# Altium schematic sheet МПСУ.464421.22-01 Switch,GPS, IO Connectors.SchDoc
size 420 x 297 mm; Address1: Address1; Address2: Address2; Address3: Address3; Address4: Address4; SheetNumber: 5; SheetTotal: 6; DocumentTypeSCH: Э3; DocumentName1SCH: Плата; NachOtdelaSCH: Орешкин; UtverjdenSCH: Утвержден
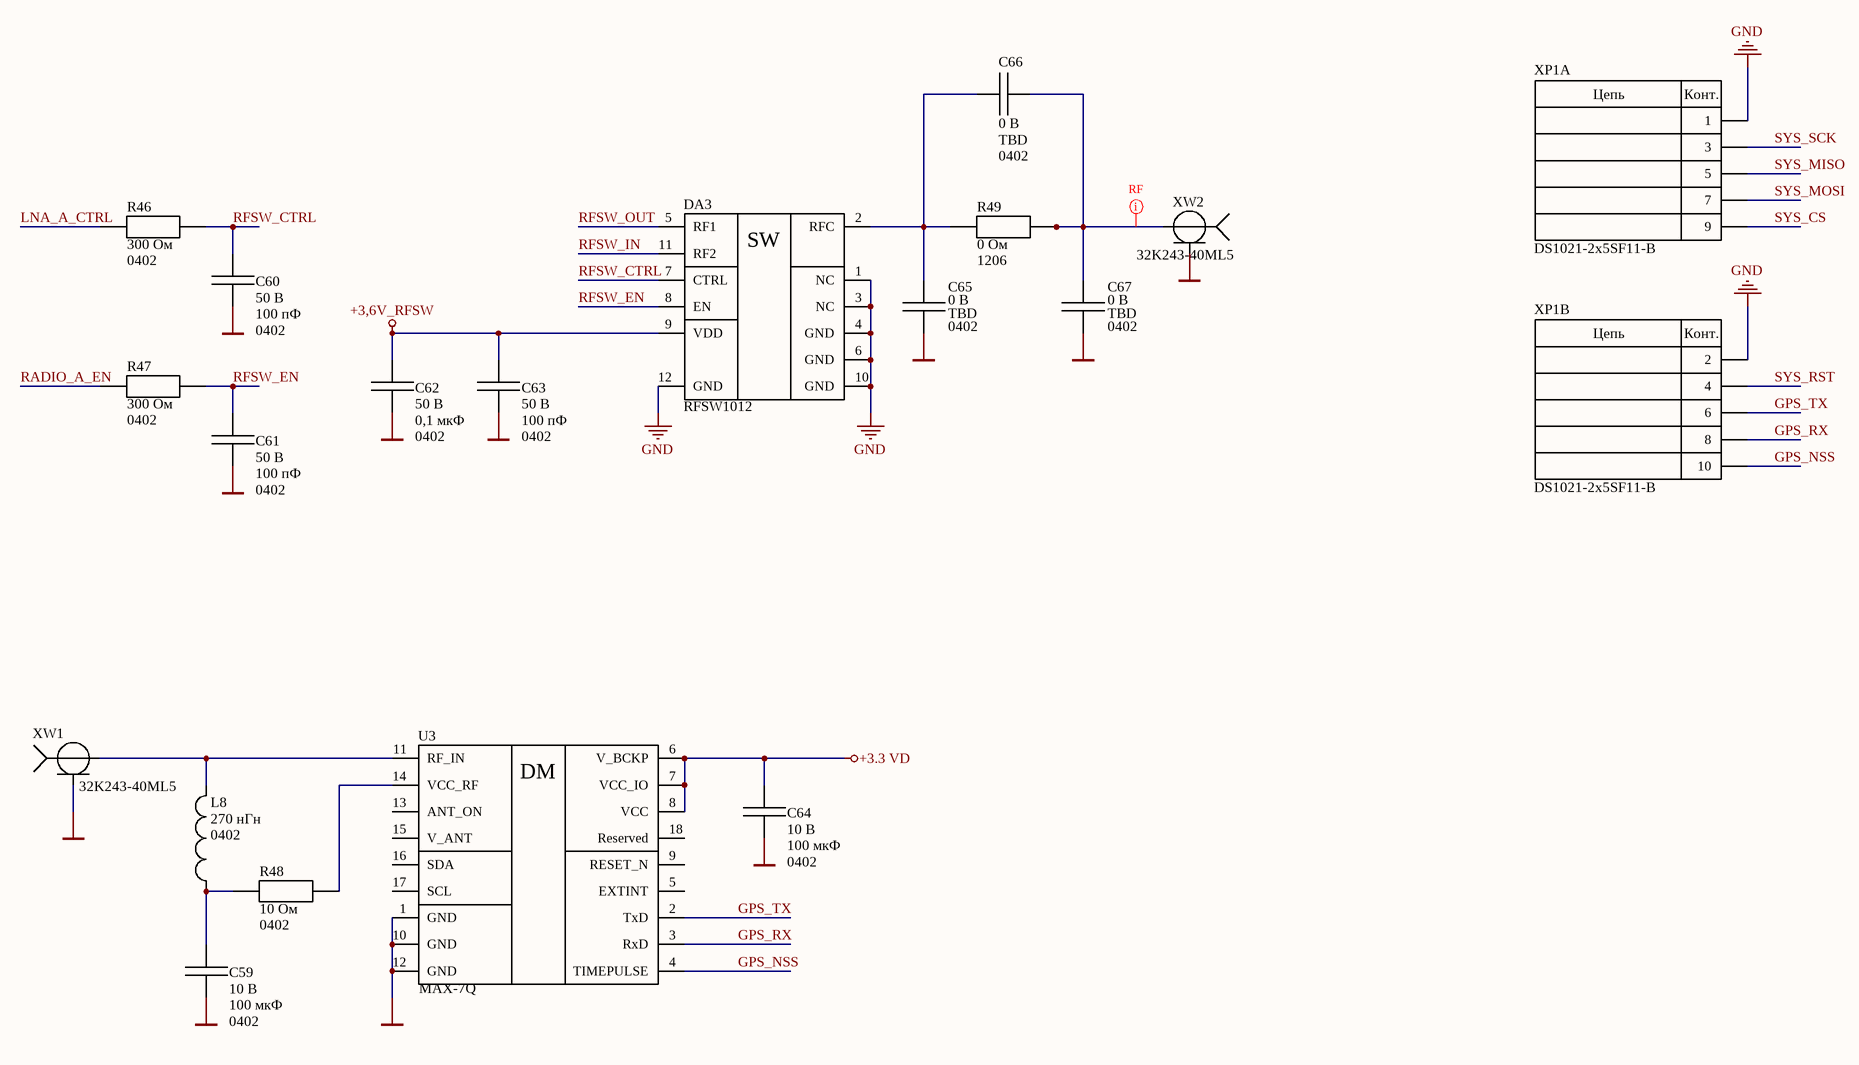
[diagram p0: МПСУ.464421.22-01 Switch,GPS, IO Connectors.SchDoc]

## Parts
C59  value 100 мкФ  Peak_Condition: 10 В  Package: 0402  [CAPC100X50X55L20N]  (hidden comment: 100 мкФ ± 20 % 10 В JB 0402 C3216JB1A107M160AC)
C60  value 100 пФ  Peak_Condition: 50 В  Package: 0402  [CAPC100X50X55L20N]  (hidden comment: 100 пФ ± 5 % 50 В C0G 0402 GRM1555C1H101JZ01D)
C61  value 100 пФ  Peak_Condition: 50 В  Package: 0402  [CAPC100X50X55L20N]  (hidden comment: 100 пФ ± 5 % 50 В C0G 0402 GRM1555C1H101JZ01D)
C62  value 0,1 мкФ  Peak_Condition: 50 В  Package: 0402  [CAPC100X50X55L20N]  (hidden comment: 0,1 мкФ ± 10 % 50 В X7R 0402 GRM155R71H104KE14J)
C63  value 100 пФ  Peak_Condition: 50 В  Package: 0402  [CAPC100X50X55L20N]  (hidden comment: 100 пФ ± 5 % 50 В C0G 0402 GRM1555C1H101JZ01D)
C64  value 100 мкФ  Peak_Condition: 10 В  Package: 0402  [CAPC100X50X55L20N]  (hidden comment: 100 мкФ ± 20 % 10 В JB 0402 C3216JB1A107M160AC)
C65  value TBD  Peak_Condition: 0 В  Package: 0402  [CAPC100X50X55L20N]  (hidden comment: TBD 0402)
C66  value TBD  Peak_Condition: 0 В  Package: 0402  [CAPC100X50X55L20N]  (hidden comment: TBD 0402)
C67  value TBD  Peak_Condition: 0 В  Package: 0402  [CAPC100X50X55L20N]  (hidden comment: TBD 0402)
DA3  RFSW1012  [PQFN50P200X200X60_HS-13N]
L8  value 270 нГн  Package: 0402  [INDC100X50X60L10N]  (hidden comment: 270 нГн ± 5 % 110 мА 0402 LQG15HSR27J02D)
R46  value 300 Ом  Package: 0402  [RESC100X50X40L25N]  (hidden comment: 300 Ом ± 5 % 0 Вт 0402 RI0402L301JT)
R47  value 300 Ом  Package: 0402  [RESC100X50X40L25N]  (hidden comment: 300 Ом ± 5 % 0 Вт 0402 RI0402L301JT)
R48  value 10 Ом  Package: 0402  [RESC100X50X40L25N]  (hidden comment: 10 Ом ± 5 % 0 Вт 0402 RI0402L100JT)
R49  value 0 Ом  Package: 1206  [RESC310X160X55L50N]  (hidden comment: 0 Ом ± 5 % 0 Вт 1206 RI1206L000JT)
U3  MAX-7Q  [MAX-7-Q0]
XP1  DS1021-2x5SF11-B  [HDRV10W64P254_5X2_1270X508H854]  (parts A,B of 2)
XW1  32K243-40ML5  [32K243-40ML5]
XW2  32K243-40ML5  [32K243-40ML5]

## Nets
+3,6V_RFSW: C62.2 C63.2 DA3.9(VDD)
+3.3 VD: C64.1 U3.6(V_BCKP) U3.7(VCC_IO) U3.8(VCC)
GND: C59.2 C60.1 C61.1 C62.1 C63.1 C64.2 C65.1 C67.1 DA3.1(NC) DA3.3(NC) DA3.4(GND) DA3.6(GND) DA3.10(GND) DA3.12(GND) U3.1(GND) U3.10(GND) U3.12(GND) XP1.1 XP1.2 XW1.2(GND) XW2.2(GND)
GPS_NSS: U3.4(TIMEPULSE) XP1.10
GPS_RX: U3.3(RxD) XP1.8
GPS_TX: U3.2(TxD) XP1.6
LNA_A_CTRL: R46.1
RADIO_A_EN: R47.1
RFSW_CTRL: C60.2 DA3.7(CTRL) R46.2
RFSW_EN: C61.2 DA3.8(EN) R47.2
RFSW_IN: DA3.11(RF2)
RFSW_OUT: DA3.5(RF1)
SYS_CS: XP1.9
SYS_MISO: XP1.5
SYS_MOSI: XP1.7
SYS_RST: XP1.4
SYS_SCK: XP1.3
NetC59_1: C59.1 L8.1 R48.1
NetC65_2: C65.2 C66.2 DA3.2(RFC) R49.1
NetC66_1: C66.1 C67.2 R49.2 XW2.1(RF)
NetL8_2: L8.2 U3.11(RF_IN) XW1.1(RF)
NetR48_2: R48.2 U3.14(VCC_RF)

Not connected (* = marked no-connect by the designer): U3 5(EXTINT) 9(RESET_N) 13(ANT_ON) 15(V_ANT) 16(SDA) 17(SCL) 18(Reserved)

## Layout directives
net class RF: NetC66_1

## Notes on the sheet
- Подп. и дата
- Инв. № дубл.
- Взам. инв. №
- Инв. № подл.
- Изм.
- Лист
- № докум.
- Подп.
- Дата
- Копировал
- Формат А3
- (in symbol DS1021-2x5SF11-B, part A) Цепь; Конт.
- (in symbol DS1021-2x5SF11-B, part B) Цепь; Конт.
- (in symbol MAX-7-*) DM
- (in symbol RFSW1012) SW

## Library data of the parts
C59 C64 = C 0402: Capacitor 0402; Manufacturer: TDK; Tolerance: 20 %; Designer: Свидерский; 3D_Body: +; PartNumber: C3216JB1A107M160AC; Category: Passive; Subcategory: Capacitor; Dielectric: JB; Status: Approved
C60 C61 C63 = C 0402: Capacitor 0402; Manufacturer: Murata; Tolerance: 5 %; Designer: Свидерский; 3D_Body: +; PartNumber: GRM1555C1H101JZ01D; Category: Passive; Subcategory: Capacitor; Dielectric: C0G; Status: Approved
C62 = C 0402: Capacitor 0402; Manufacturer: Murata; Tolerance: 10 %; Designer: Свидерский; 3D_Body: +; PartNumber: GRM155R71H104KE14J; Category: Passive; Subcategory: Capacitor; Dielectric: X7R; Status: Approved
C65-C67 = C 0402: Capacitor 0402; Tolerance: 0 %; Designer: Свидерский; Notes: CP; 3D_Body: +; Category: Passive; Subcategory: Capacitor; Status: Approved
DA3 = RFSW1012: Broadband SPDT Switch 0.005-6 GHz; Manufacturer: Qorvo; Designer: Лазба; 3D_Body: +; ComponentLink1Description: Техническое описание; ComponentLink1URL: Q:\Libs\Descriptions_PDF\RFSW1012 Data Sheet.pdf; Category: IC; Subcategory: Switch; Status: Check; Package: *; PartNumber: RFSW1012
L8 = L 0402: Inductor 0402; Manufacturer: Murata; Designer: Свидерский; 3D_Body: +; Tolerance: 5 %; Peak_Condition: 110 мА; PartNumber: LQG15HSR27J02D; Category: Passive; Subcategory: Inductor; Status: Approved
R46-R48 = R 0402: Resistor 0402; Manufacturer: Hottech; Designer: Свидерский; 3D_Body: +; Tolerance: 5 %; Peak_Condition: 0 Вт; Category: Passive; Subcategory: Resistor; Status: Approved
  R46 R47: PartNumber: RI0402L301JT
  R48: PartNumber: RI0402L100JT
R49 = R 1206: Resistor 1206; Manufacturer: Hottech; Designer: Свидерский; 3D_Body: +; Tolerance: 5 %; Peak_Condition: 0 Вт; PartNumber: RI1206L000JT; Category: Passive; Subcategory: Resistor; Status: Approved
U3 = MAX-7-*: GPS/GNSS Module; Manufacturer: u-blox; Designer: Лазба; 3D_Body: +; ComponentLink1Description: Техническое описание; ComponentLink1URL: Q:\Libs\Descriptions_PDF\MAX_7_DataSheet__UBX_13004068_-2010070.pdf; Category: IC; Subcategory: Transciever; Status: Check; PartNumber: MAX-7Q
XP1 = DS1021-2x5SF11-B: Вилка 2,54мм; Manufacturer: Connfly Electronic; 3D_Body: +; Designer: Свидерский; Pitch: 2.54mm; System: Connector; ComponentLink1Description: Техническое описание; ComponentLink1URL: Q:\Libs\Descriptions_PDF\DS1021.pdf; Category: Connector; Subcategory: Male; Pins: 2x5; Status: Approved; PartNumber: DS1021-2x5SF11-B
XW1 XW2 = 32K243-40ML5: RF connector, Right Angle Jack PCB SMA Female End Launch Connector; Manufacturer: Rosenberger; 3D_Body: +; Designer: Шеремет; Pitch: 3.5mm; ComponentLink1Description: Техническое описание; ComponentLink1URL: Q:\Libs\Descriptions_PDF\32K243-40ML5.pdf; Category: Connector; Subcategory: RF; Pins: Coax; Status: Approved; System: Connector; PartNumber: 32K243-40ML5